# EasyEDA Pro project STM32F429BIT6 IGT6外围.epro, board Demo0
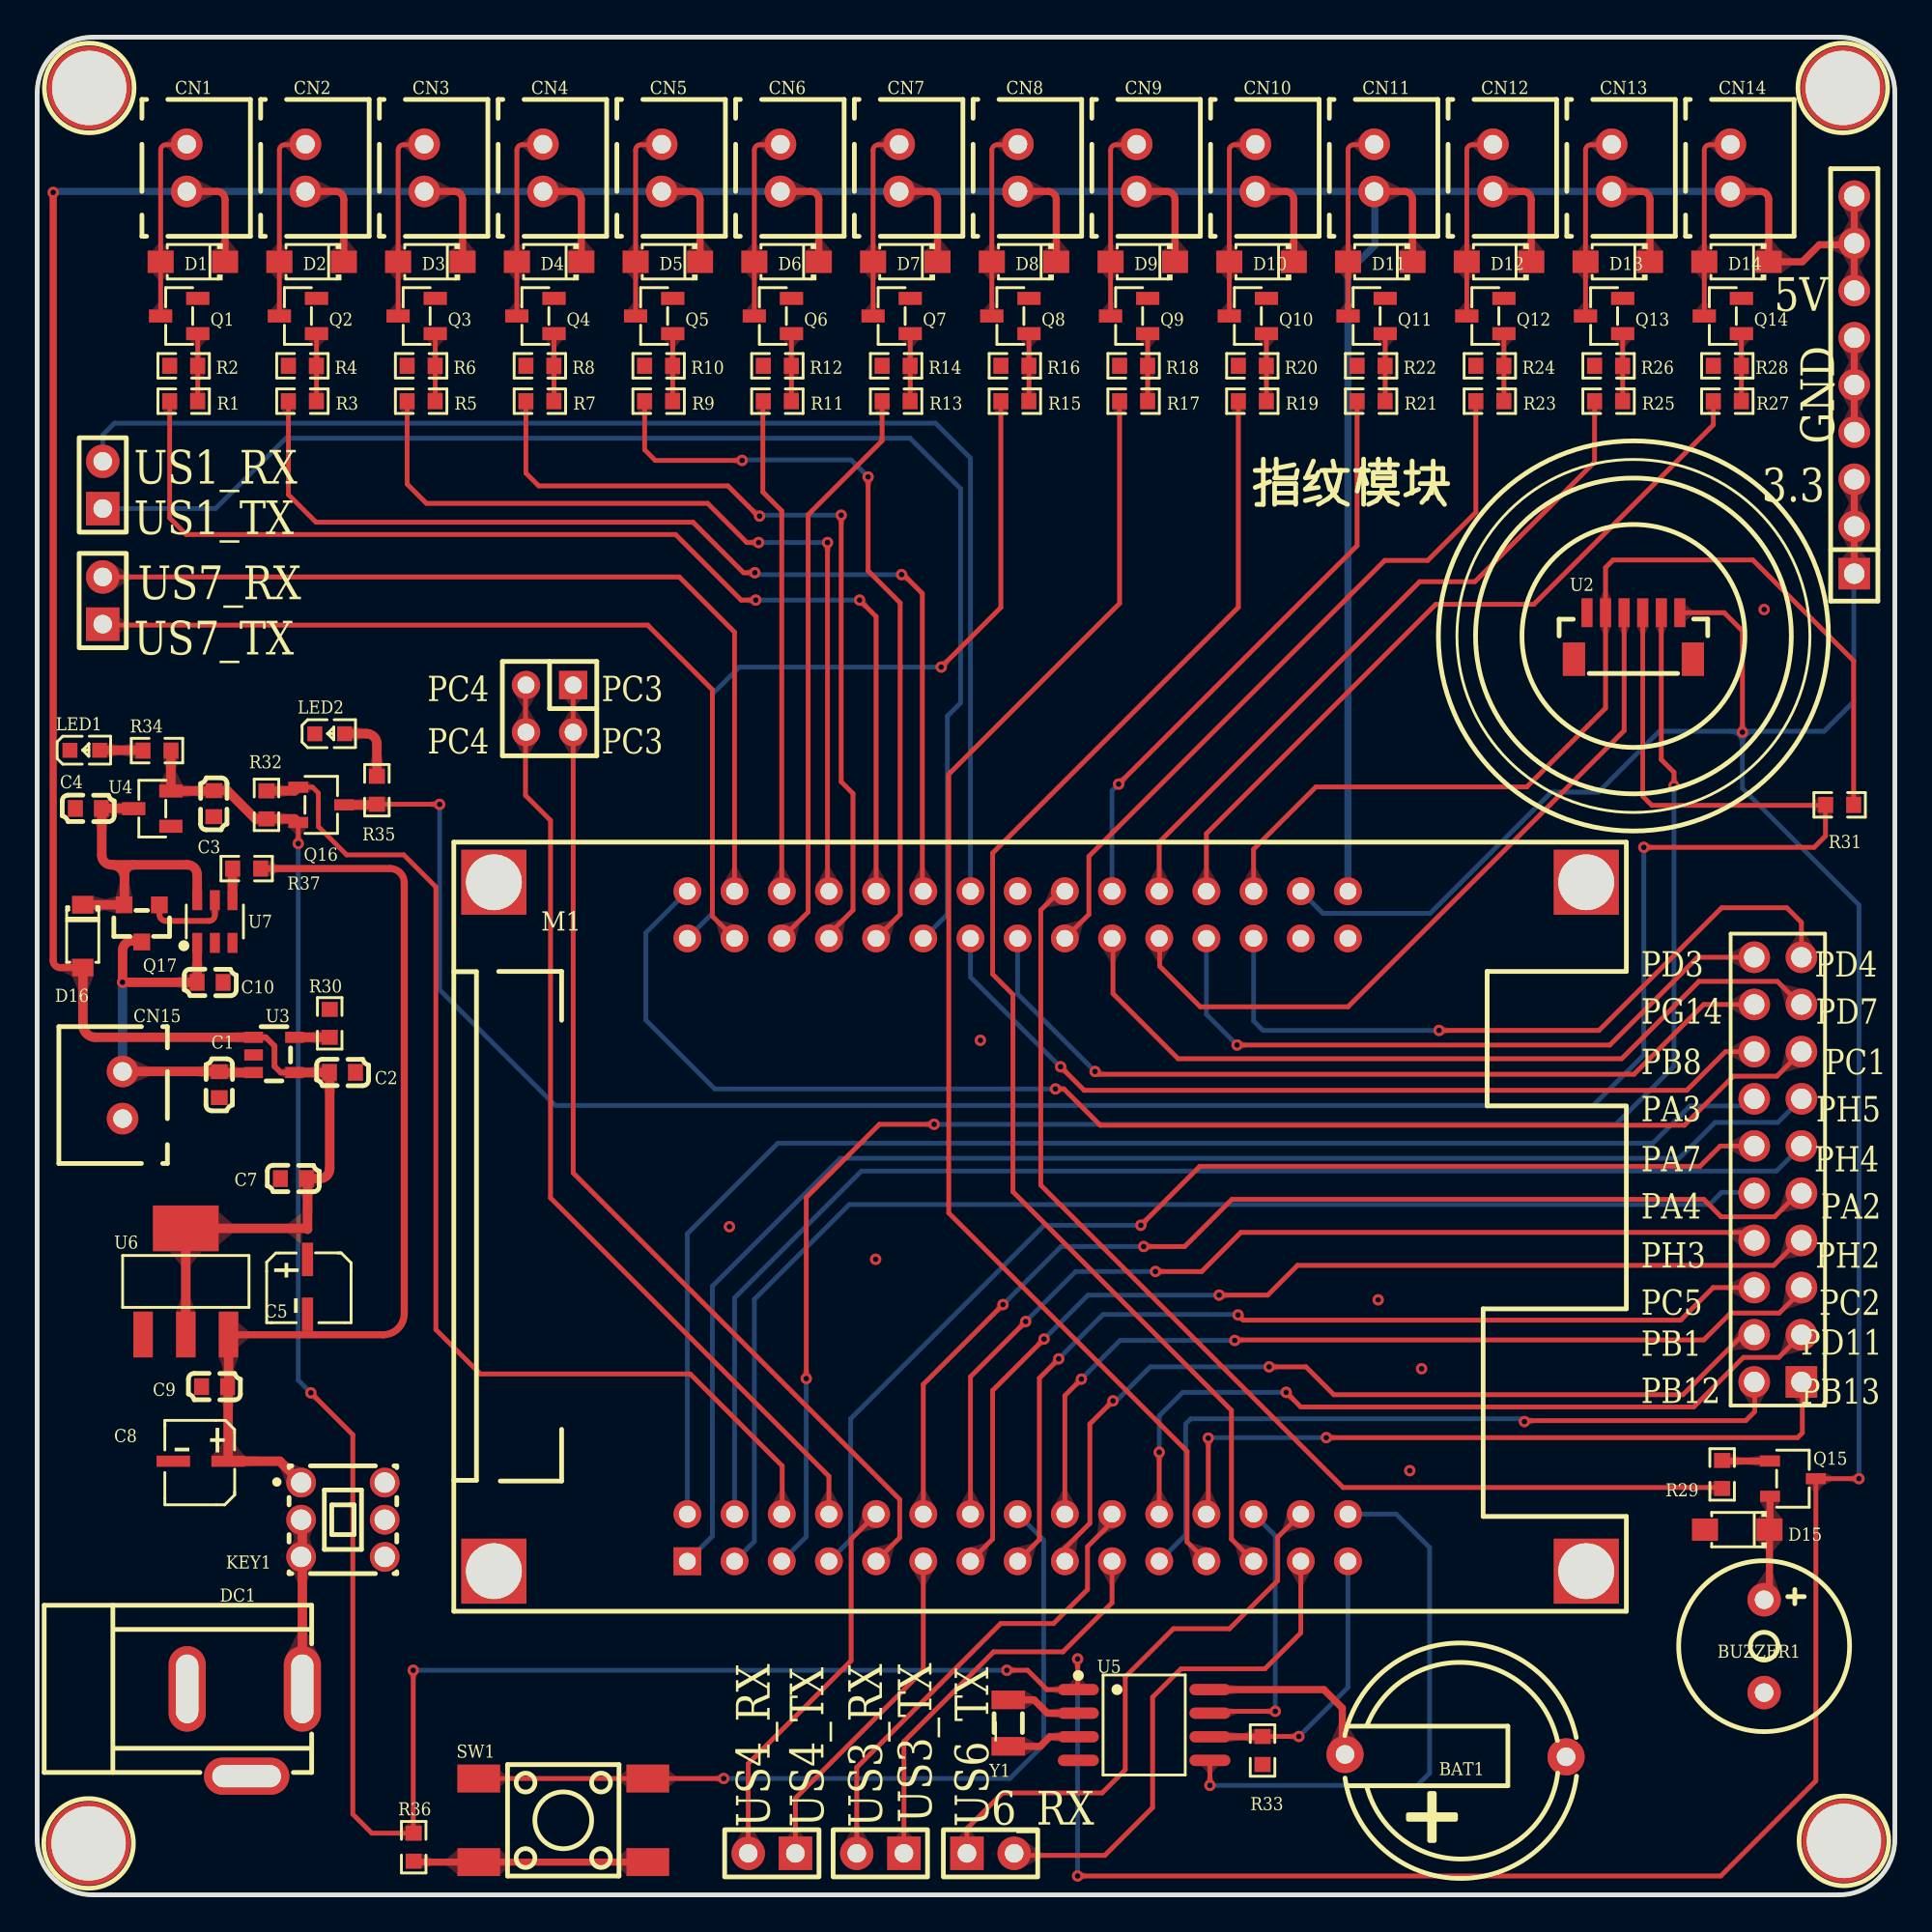
[diagram p3: board, top side]
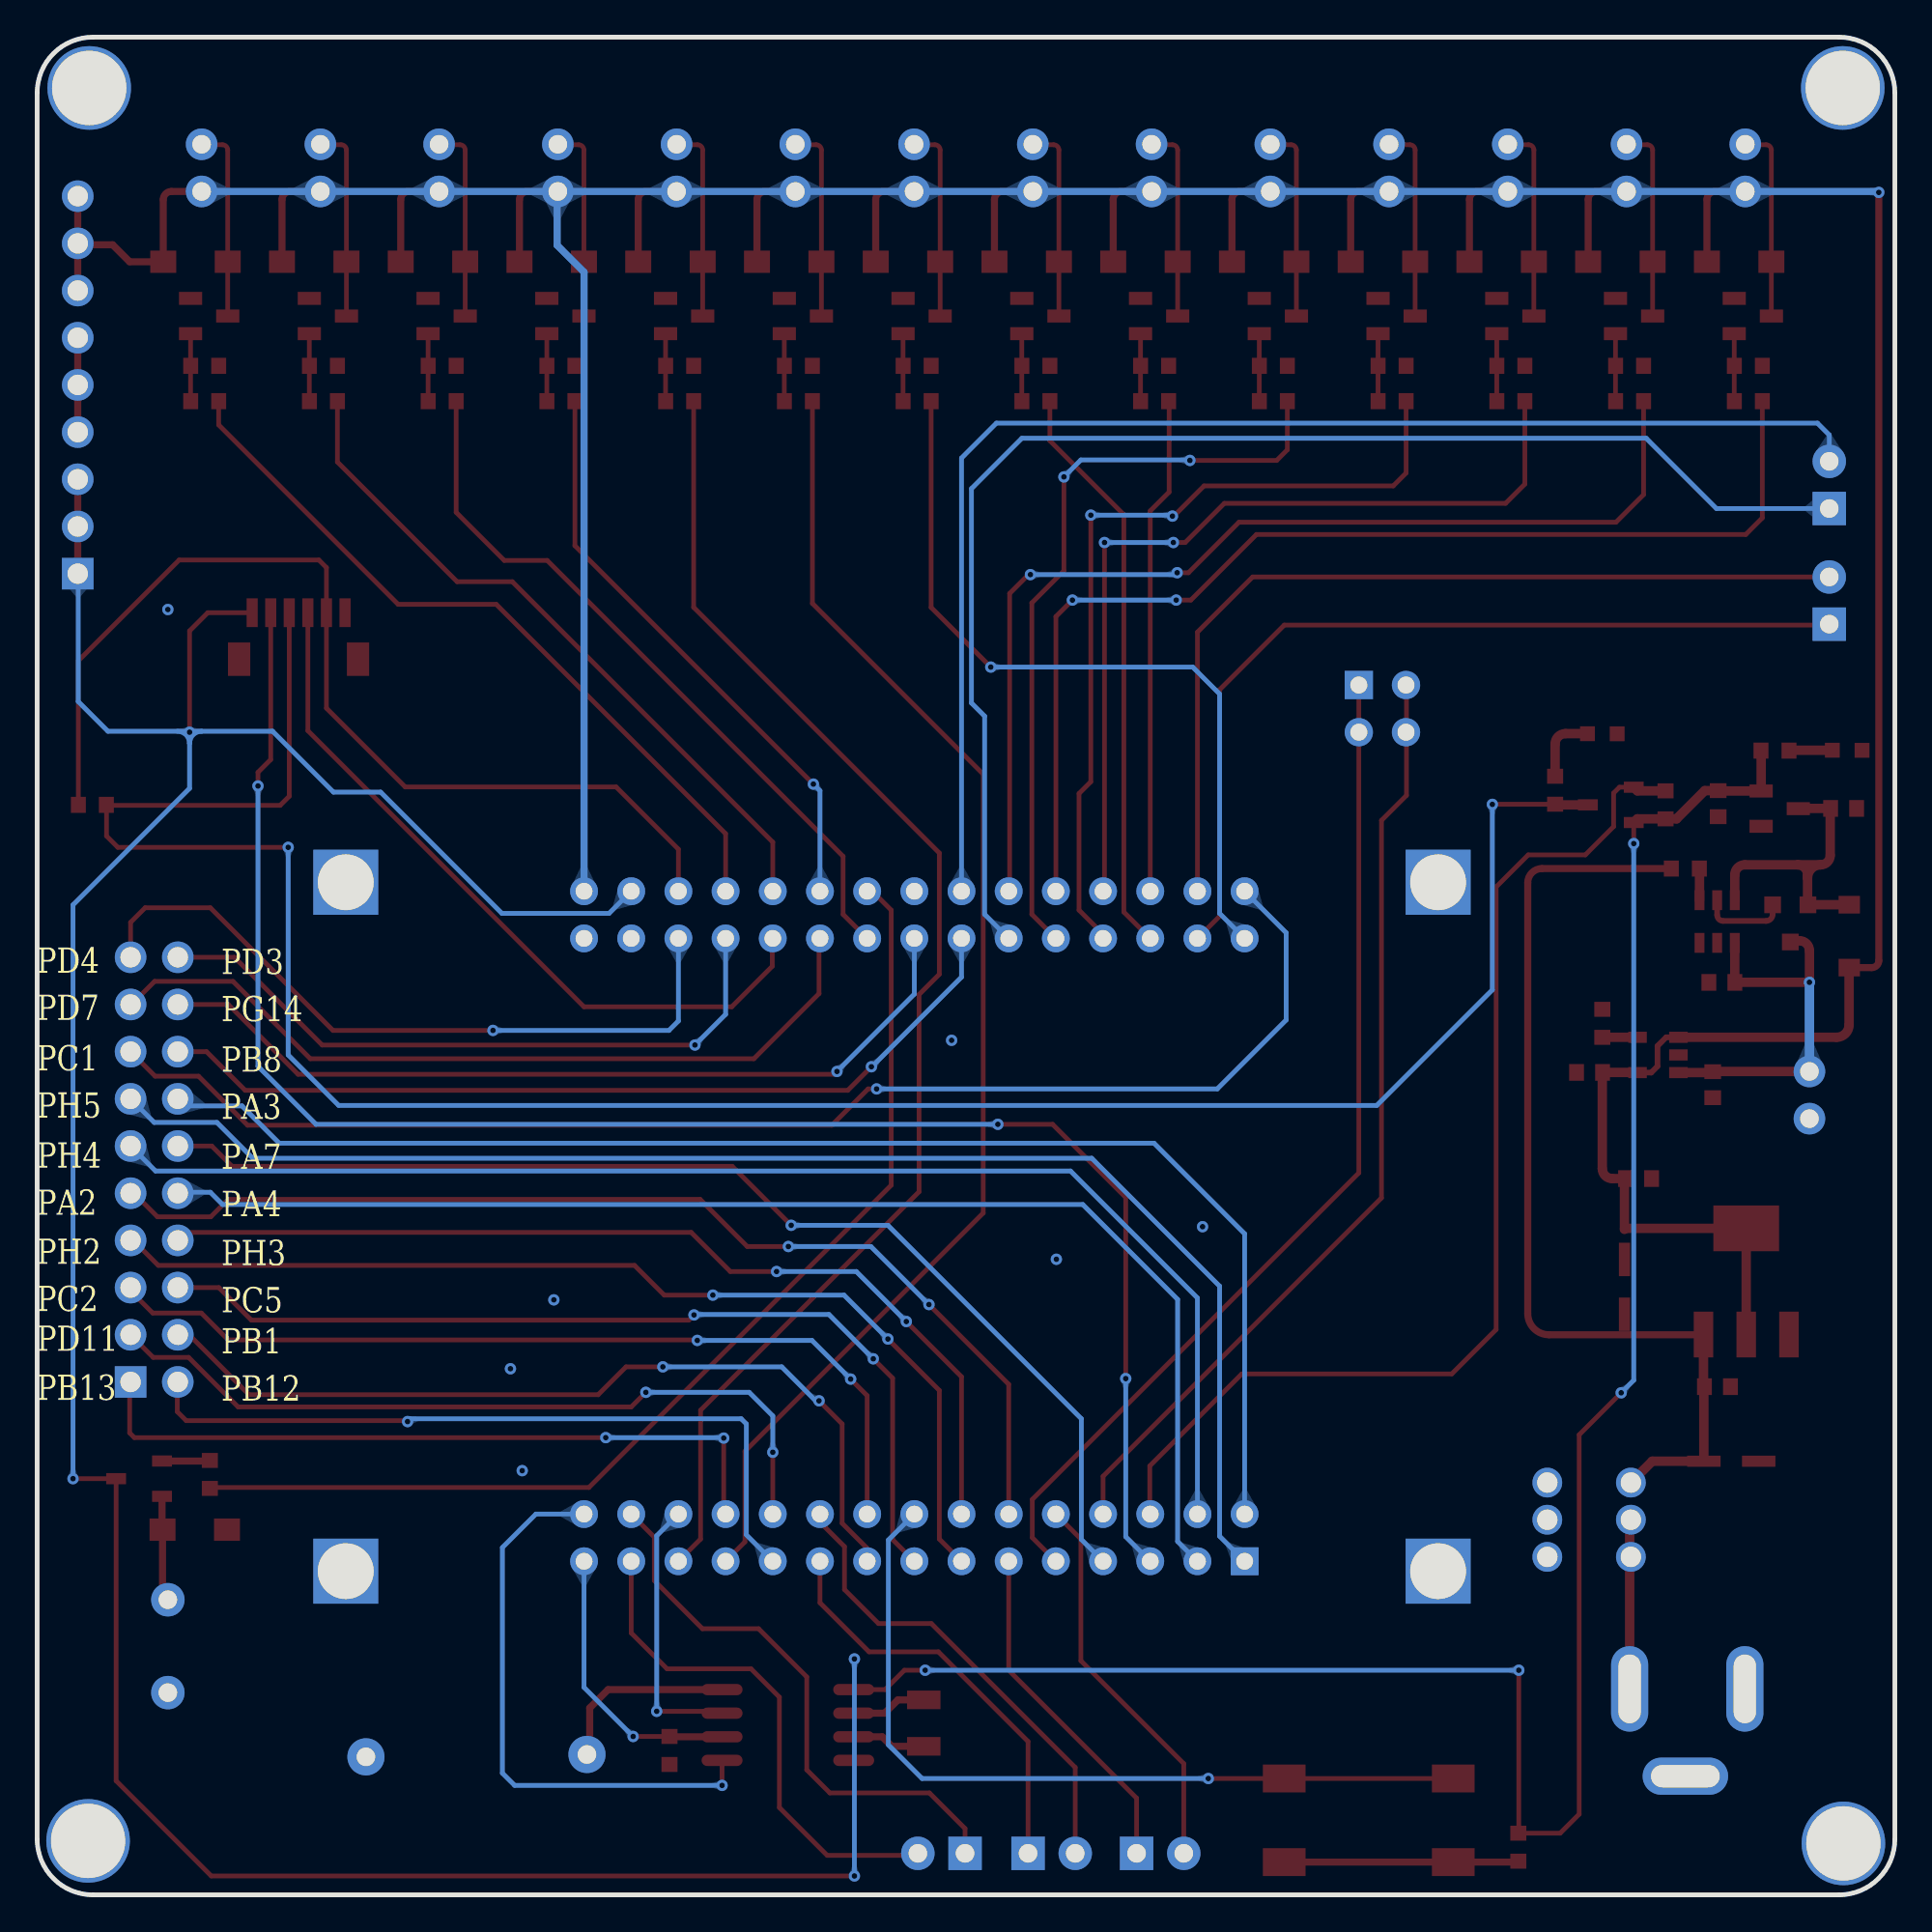
[diagram p4: board, bottom side, seen from below]

Outline 100 x 100 mm; copper layers: Top Layer, Bottom Layer. Coordinates in mm from the lower left corner of the outline.
Outline path: 0,97 0,3 arc(0.88,0.88) 3,0 97,0 arc(99.12,0.88) 100,3 100,97 arc(99.12,99.12) 97,100 3,100 arc(0.88,99.12) 0,97
Stack: Top Layer 0.035mm / Dielectric1 1.51mm FR4 er 4.5 / Bottom Layer 0.035mm

## Design rules (mm)
spacing Default (default): track to track 0.152, other pairs 0 to 0.152
track width Default (default): min 0.254, default 0.254, max 25.4
differential pair differentialPair (default): width min 0.127, default 0.254, max 2.54; gap min 0.152, default 0.152
via Default (default): diameter min 0.61, default 0.61, max 100.025; hole min 0.305, default 0.305, max 59.995

## Placement (name value [footprint] x y rotation side)
BAT1  CR1220-H DIP  [BAT-TH_CR1220-H-DIP]  76.35 7.49 180 top
BUZZER1  2800Hz  [BUZ-TH_BD9.0-P5.00-D0.6-FD]  92.96 13.39 270 top
C1  10uF  [C0603]  9.8 43.61 90 top
C2  10uF  [C0603]  16.43 44.27 180 top
C3  1uF  [C0603]  9.51 58.74 90 top
C4  1uF  [C0603]  2.76 58.48 0 top
C5  22uF  [CAP-SMD_BD6.3-L6.6-W6.6-RD#2]  14.55 34.19 90 top
C7  100nF  [C0603]  13.8 38.56 0 top
C8  22uF  [CAP-SMD_BD6.3-L6.6-W6.6-RD]  8.61 23.09 0 top
C9  100nF  [C0603]  9.55 27.36 0 top
C10  1uF  [C0603]  9.31 49.12 180 top
CN1  B2B-XH-A(LF)(SN)  [CONN-TH_B2B-XH-A-LF-SN]  8.05 92.96 270 top
CN2  B2B-XH-A(LF)(SN)  [CONN-TH_B2B-XH-A-LF-SN]  14.44 92.96 270 top
CN3  B2B-XH-A(LF)(SN)  [CONN-TH_B2B-XH-A-LF-SN]  20.84 92.96 270 top
CN4  B2B-XH-A(LF)(SN)  [CONN-TH_B2B-XH-A-LF-SN]  27.23 92.96 270 top
CN5  B2B-XH-A(LF)(SN)  [CONN-TH_B2B-XH-A-LF-SN]  33.62 92.96 270 top
CN6  B2B-XH-A(LF)(SN)  [CONN-TH_B2B-XH-A-LF-SN]  40.01 92.96 270 top
CN7  B2B-XH-A(LF)(SN)  [CONN-TH_B2B-XH-A-LF-SN]  46.4 92.96 270 top
CN8  B2B-XH-A(LF)(SN)  [CONN-TH_B2B-XH-A-LF-SN]  52.8 92.96 270 top
CN9  B2B-XH-A(LF)(SN)  [CONN-TH_B2B-XH-A-LF-SN]  59.19 92.96 270 top
CN10  B2B-XH-A(LF)(SN)  [CONN-TH_B2B-XH-A-LF-SN]  65.58 92.96 270 top
CN11  B2B-XH-A(LF)(SN)  [CONN-TH_B2B-XH-A-LF-SN]  71.97 92.96 270 top
CN12  B2B-XH-A(LF)(SN)  [CONN-TH_B2B-XH-A-LF-SN]  78.36 92.96 270 top
CN13  B2B-XH-A(LF)(SN)  [CONN-TH_B2B-XH-A-LF-SN]  84.75 92.96 270 top
CN14  B2B-XH-A(LF)(SN)  [CONN-TH_B2B-XH-A-LF-SN]  91.15 92.96 270 top
CN15  B2B-XH-A(LF)(SN)  [CONN-TH_B2B-XH-A-LF-SN]  4.6 43.05 90 top
D1  DSK34  [SOD-123FL_L2.7-W1.8-LS3.8-RD]  8.38 87.91 180 top
D2  DSK34  [SOD-123FL_L2.7-W1.8-LS3.8-RD]  14.77 87.91 180 top
D3  DSK34  [SOD-123FL_L2.7-W1.8-LS3.8-RD]  21.17 87.91 180 top
D4  DSK34  [SOD-123FL_L2.7-W1.8-LS3.8-RD]  27.56 87.91 180 top
D5  DSK34  [SOD-123FL_L2.7-W1.8-LS3.8-RD]  33.95 87.91 180 top
D6  DSK34  [SOD-123FL_L2.7-W1.8-LS3.8-RD]  40.34 87.91 180 top
D7  DSK34  [SOD-123FL_L2.7-W1.8-LS3.8-RD]  46.73 87.91 180 top
D8  DSK34  [SOD-123FL_L2.7-W1.8-LS3.8-RD]  53.13 87.91 180 top
D9  DSK34  [SOD-123FL_L2.7-W1.8-LS3.8-RD]  59.52 87.91 180 top
D10  DSK34  [SOD-123FL_L2.7-W1.8-LS3.8-RD]  65.91 87.91 180 top
D11  DSK34  [SOD-123FL_L2.7-W1.8-LS3.8-RD]  72.3 87.91 180 top
D12  DSK34  [SOD-123FL_L2.7-W1.8-LS3.8-RD]  78.69 87.91 180 top
D13  DSK34  [SOD-123FL_L2.7-W1.8-LS3.8-RD]  85.09 87.91 180 top
D14  DSK34  [SOD-123FL_L2.7-W1.8-LS3.8-RD]  91.48 87.91 180 top
D15  DSK34  [SOD-123FL_L2.7-W1.8-LS3.8-RD]  91.52 19.66 180 top
D16  1N5819W  [SOD-123_L2.8-W1.8-LS3.7-RD]  2.45 51.61 270 top
DC1  DC005  [DC-IN-TH_DC005]  11.18 8.74 0 top
H1  -  [HDR-TH_2P-P2.54-V-M-1]  3.53 75.9 90 top
H2  -  [HDR-TH_2P-P2.54-V-M-1]  45.39 2.24 180 top
H3  -  [HDR-TH_2P-P2.54-V-M-1]  51.32 2.24 0 top
H4  -  [HDR-TH_2P-P2.54-V-M-1]  39.55 2.24 180 top
H5  -  [HDR-TH_2P-P2.54-V-M-1]  3.53 69.67 90 top
H6  -  [HDR-TH_9P-P2.54-V-M]  97.82 81.28 90 top
H7  -  [HDR-TH_20P-P2.54-V-M-R2-C10-S2.54]  93.7 39.04 90 top
H8  -  [HDR-TH_4P-P2.54-V-M-R2-C2-S2.54-1]  27.58 63.86 180 top
KEY1  自锁开关 5.8Z白灰白260G  [SW-TH_6P-L5.8-W5.8-P2.00-LS4.5-TR]  16.46 20.19 90 top
LED1  -  [LED_0603]  2.62 61.62 0 top
LED2  -  [LED_0603]  15.8 62.51 0 top
M1  STM32F429BIT6-Module  [STM32F429BI_CORE]  52.78 35.99 0 top
Q1  AO3400  [SOT-23-3_L2.9-W1.3-P1.90-LS2.4-BR]  7.65 84.99 0 top
Q2  AO3400  [SOT-23-3_L2.9-W1.3-P1.90-LS2.4-BR]  14.04 84.99 0 top
Q3  AO3400  [SOT-23-3_L2.9-W1.3-P1.90-LS2.4-BR]  20.43 84.99 0 top
Q4  AO3400  [SOT-23-3_L2.9-W1.3-P1.90-LS2.4-BR]  26.82 84.99 0 top
Q5  AO3400  [SOT-23-3_L2.9-W1.3-P1.90-LS2.4-BR]  33.21 84.99 0 top
Q6  AO3400  [SOT-23-3_L2.9-W1.3-P1.90-LS2.4-BR]  39.6 84.99 0 top
Q7  AO3400  [SOT-23-3_L2.9-W1.3-P1.90-LS2.4-BR]  46 84.99 0 top
Q8  AO3400  [SOT-23-3_L2.9-W1.3-P1.90-LS2.4-BR]  52.39 84.99 0 top
Q9  AO3400  [SOT-23-3_L2.9-W1.3-P1.90-LS2.4-BR]  58.78 84.99 0 top
Q10  AO3400  [SOT-23-3_L2.9-W1.3-P1.90-LS2.4-BR]  65.17 84.99 0 top
Q11  AO3400  [SOT-23-3_L2.9-W1.3-P1.90-LS2.4-BR]  71.56 84.99 0 top
Q12  AO3400  [SOT-23-3_L2.9-W1.3-P1.90-LS2.4-BR]  77.96 84.99 0 top
Q13  AO3400  [SOT-23-3_L2.9-W1.3-P1.90-LS2.4-BR]  84.35 84.99 0 top
Q14  AO3400  [SOT-23-3_L2.9-W1.3-P1.90-LS2.4-BR]  90.74 84.99 0 top
Q15  S8050  [SOT-23-3_L2.9-W1.6-P1.90-LS2.8-BR]  94.51 22.4 180 top
Q16  SI2305  [SOT-23-3_L2.9-W1.6-P1.90-LS2.8-BR]  15.29 58.67 180 top
Q17  FH3415J  [SOT-23_L2.9-W1.3-P1.90-LS2.4-BL]  5.63 52.29 180 top
R1  1K  [R0603]  7.89 80.4 0 top
R2  10K  [R0603]  7.89 82.31 180 top
R3  1K  [R0603]  14.28 80.4 0 top
R4  10K  [R0603]  14.28 82.31 180 top
R5  1K  [R0603]  20.67 80.4 0 top
R6  10K  [R0603]  20.67 82.31 180 top
R7  1K  [R0603]  27.06 80.4 0 top
R8  10K  [R0603]  27.06 82.31 180 top
R9  1K  [R0603]  33.45 80.4 0 top
R10  10K  [R0603]  33.45 82.31 180 top
R11  1K  [R0603]  39.85 80.4 0 top
R12  10K  [R0603]  39.85 82.31 180 top
R13  1K  [R0603]  46.24 80.4 0 top
R14  10K  [R0603]  46.24 82.31 180 top
R15  1K  [R0603]  52.63 80.4 0 top
R16  10K  [R0603]  52.63 82.31 180 top
R17  1K  [R0603]  59.02 80.4 0 top
R18  10K  [R0603]  59.02 82.31 180 top
R19  1K  [R0603]  65.41 80.4 0 top
R20  10K  [R0603]  65.41 82.31 180 top
R21  1K  [R0603]  71.81 80.4 0 top
R22  10K  [R0603]  71.81 82.31 180 top
R23  1K  [R0603]  78.2 80.4 0 top
R24  10K  [R0603]  78.2 82.31 180 top
R25  1K  [R0603]  84.59 80.4 0 top
R26  10K  [R0603]  84.59 82.31 180 top
R27  1K  [R0603]  90.98 80.4 0 top
R28  10K  [R0603]  90.98 82.31 180 top
R29  1K  [R0603]  90.7 22.63 90 top
R30  2K 1%  [R0603]  15.75 46.91 270 top
R31  10K  [R0603]  97.03 58.67 180 top
R32  100K  [R0603]  12.34 58.67 270 top
R33  10K  [R0603]  65.96 7.77 90 top
R34  5.1K  [R0603]  6.45 61.59 0 top
R35  5.1K  [R0603]  18.29 59.46 270 top
R36  1K  [R0603]  20.27 2.57 90 top
R37  470K  [R0603]  11.28 55.25 180 top
SW1  -  [SW-SMD_4P-L6.0-W6.0-P4.50-LS9.0-2]  28.32 4.01 0 top
TP1  -  [M4螺丝]  2.77 2.77 0 top
TP2  -  [M4螺丝]  97.26 2.9 0 top
TP3  -  [M4螺丝]  2.8 97.27 0 top
TP4  -  [M4螺丝]  97.2 97.27 0 top
U2  指纹模块  [CONN-SMD_A1002WV-S-6P]  85.93 67.77 0 top
U3  LGS7381  [SOT-23-5_L2.9-W1.6-P0.95-LS2.8-BR]  12.75 45.21 180 top
U4  XC6206  [SOT-23-3_L2.9-W1.3-P1.90-LS2.4-BR]  6.2 58.47 0 top
U5  DS1302S+T&R  [SOP-8_L5.3-W5.3-P1.27-LS8.0-BL]  59.59 9.14 270 top
U6  AMS1117-5.0  [SOT-223_L6.5-W3.5-P2.30-LS7.0-BR]  8 33.02 270 top
U7  LTC4412MPS6#TRPBF  [SOT-23-6_L2.9-W1.6-P0.95-LS2.8-BL]  9.57 52.39 0 top
Y1  32.768kHz  [FC-135R_L3.2-W1.5]  52.27 9.25 90 top

## Footprints (pads in the part's own frame, mm; a bottom-side part is the same pattern mirrored in y, then rotated)
BAT-TH_CR1220-H-DIP
  round 2 hole 1: 1(-5.949,0.064) 2(5.949,-0.064)
BUZ-TH_BD9.0-P5.00-D0.6-FD
  round 1.8 hole 1: 1(-2.5,0) 2(2.5,0)
C0603
  rect 0.8x0.9 smd: 1(-0.7,0) 2(0.7,0)
CAP-SMD_BD6.3-L6.6-W6.6-RD
  rect 1.8x0.6 smd: 1(1.67,0.254) 2(-1.282,0.254)
CAP-SMD_BD6.3-L6.6-W6.6-RD#2
  rect 1.8x0.6 smd: 1(0.016,0) 2(-2.936,0)
CONN-SMD_A1002WV-S-6P
  rect 0.6x1.55 smd: 1(2.499,1.251) 2(1.499,1.251) 3(0.501,1.25) 4(-0.501,1.251) 5(-1.501,1.251) 6(-2.501,1.251)
  rect 1.2x1.8 smd: 7(3.201,-1.251) 8(-3.201,-1.251)
CONN-TH_B2B-XH-A-LF-SN
  round 1.7 hole 1: 1(1.27,0) 2(-1.27,0)
DC-IN-TH_DC005
  oval 2x4.6 hole 1.2x3.7: 1(3.1,2.35) 2(-3.1,2.35)
  oval 4.6x2 hole 3.7x1.2: 3(0.1,-2.35)
FC-135R_L3.2-W1.5
  rect 1x1.8 smd: 1(-1.25,0) 2(1.25,0)
HDR-TH_2P-P2.54-V-M-1
  rect 1.8x1.8 hole 1: 1(-1.27,0)
  round 1.8 hole 1: 2(1.27,0)
HDR-TH_4P-P2.54-V-M-R2-C2-S2.54-1
  rect 1.524x1.524 hole 0.914: 1(-1.27,-1.27)
  round 1.524 hole 0.914: 2(-1.27,1.27) 3(1.27,-1.27) 4(1.27,1.27)
HDR-TH_9P-P2.54-V-M
  rect 1.7x1.7 hole 1.1: 1(-10.16,0)
  round 1.7 hole 1.1: 2(-7.62,0) 3(-5.08,0) 4(-2.54,0) 5(0,0) 6(2.54,0) 7(5.08,0) 8(7.62,0) 9(10.16,0)
HDR-TH_20P-P2.54-V-M-R2-C10-S2.54
  rect 1.7x1.7 hole 1.1: 1(-11.43,-1.27)
  round 1.7 hole 1.1: 2(-11.43,1.27) 3(-8.89,-1.27) 4(-8.89,1.27) 5(-6.35,-1.27) 6(-6.35,1.27) 7(-3.81,-1.27) 8(-3.81,1.27) 9(-1.27,-1.27) 10(-1.27,1.27) 11(1.27,-1.27) 12(1.27,1.27) 13(3.81,-1.27) 14(3.81,1.27) 15(6.35,-1.27) 16(6.35,1.27) 17(8.89,-1.27) 18(8.89,1.27) 19(11.43,-1.27) 20(11.43,1.27)
LED_0603
  rect 0.8x0.8 smd: 1(-0.851,-0.01) 2(0.75,-0.005)
M4螺丝
  round 4.5 hole 4: 1(0,0)
R0603
  rect 0.806x0.864 smd: 1(-0.753,0) 2(0.753,0)
SOD-123_L2.8-W1.8-LS3.7-RD
  rect 0.95x1.15 smd: 1(-1.692,0) 2(1.692,0)
SOD-123FL_L2.7-W1.8-LS3.8-RD
  rect 1.4x1.2 smd: 1(-1.735,0) 2(1.735,0)
SOP-8_L5.3-W5.3-P1.27-LS8.0-BL
  oval 0.609x2.204 smd: 1(-1.905,-3.542) 2(-0.635,-3.542) 3(0.635,-3.542) 4(1.905,-3.542) 5(1.905,3.542) 6(0.635,3.542) 7(-0.635,3.542) 8(-1.905,3.542)
SOT-23-3_L2.9-W1.3-P1.90-LS2.4-BR
  rect 1.25x0.7 smd: 1(1,-0.95) 2(1,0.95) 3(-1,0)
SOT-23-3_L2.9-W1.6-P1.90-LS2.8-BR
  rect 1.07x0.6 smd: 1(1.235,-0.95) 2(1.235,0.95) 3(-1.235,0)
SOT-23-5_L2.9-W1.6-P0.95-LS2.8-BR
  rect 1x0.6 smd: 1(1.1,-0.95) 2(1.1,0) 3(1.1,0.95) 4(-1.1,0.95) 5(-1.1,-0.95)
SOT-23-6_L2.9-W1.6-P0.95-LS2.8-BL
  rect 0.532x1.072 smd: 1(-0.95,-1.149) 2(0,-1.149) 3(0.95,-1.149) 4(0.95,1.149) 5(0,1.149) 6(-0.95,1.149)
SOT-23_L2.9-W1.3-P1.90-LS2.4-BL
  rect 0.9x0.9 smd: 1(-0.95,-1) 2(0.95,-1) 3(0,1)
SOT-223_L6.5-W3.5-P2.30-LS7.0-BR
  rect 2.465x1.05 smd: 1(2.857,-2.3) 2(2.857,0) 3(2.857,2.3)
  rect 2.465x3.54 smd: 4(-2.857,0)
STM32F429BI_CORE
  rect 3.5x3.5 hole 3.005x3: 0(30.607,18.517) 61(30.607,-18.567) 62(-28.194,-18.567) 63(-28.194,18.517)
  rect 1.5x1.5 hole 0.905x0.9: 1(-17.78,-18.034)
  round 1.5 hole 0.905x0.9: 2(-17.78,-15.494) 3(-15.24,-18.034) 4(-15.24,-15.494) 5(-12.7,-18.034) 6(-12.7,-15.494) 7(-10.16,-18.034) 8(-10.16,-15.494) 9(-7.62,-18.034) 10(-7.62,-15.494) 11(-5.08,-18.034) 12(-5.08,-15.494) 13(-2.54,-18.034) 14(-2.54,-15.494) 15(0,-18.034) 16(0,-15.494) 17(2.54,-18.034) 18(2.54,-15.494) 19(5.08,-18.034) 20(5.08,-15.494) 21(7.62,-18.034) 22(7.62,-15.494) 23(10.16,-18.034) 24(10.16,-15.494) 25(12.7,-18.034) 26(12.7,-15.494) 27(15.24,-18.034) 28(15.24,-15.494) 29(17.78,-18.034) 30(17.78,-15.494) 31(-17.78,15.494) 32(-17.78,18.034) 33(-15.24,15.494) 34(-15.24,18.034) 35(-12.7,15.494) 36(-12.7,18.034) 37(-10.16,15.494) 38(-10.16,18.034) 39(-7.62,15.494) 40(-7.62,18.034) 41(-5.08,15.494) 42(-5.08,18.034) 43(-2.54,15.494) 44(-2.54,18.034) 45(0,15.494) 46(0,18.034) 47(2.54,15.494) 48(2.54,18.034) 49(5.08,15.494) 50(5.08,18.034) 51(7.62,15.494) 52(7.62,18.034) 53(10.16,15.494) 54(10.16,18.034) 55(12.7,15.494) 56(12.7,18.034) 57(15.24,15.494) 58(15.24,18.034) 59(17.78,15.494) 60(17.78,18.034)
SW-SMD_4P-L6.0-W6.0-P4.50-LS9.0-2
  rect 2.3x1.5 smd: 1(-4.55,2.25) 2(4.55,2.25) 3(-4.55,-2.25) 4(4.55,-2.25)
SW-TH_6P-L5.8-W5.8-P2.00-LS4.5-TR
  round 1.6 hole 1.1: 1(2,2.25) 2(0,2.25) 3(-2,2.25) 4(-2,-2.25) 5(0,-2.25) 6(2,-2.25)

## Nets
+3.3V: C3.2 H6.1 H6.2 H6.3 M1.58 Q15.3 Q16.2 R32.2 R34.2 R36.2 U2.1 U4.2 U5.1
+5V: C2.2 C5.1 C7.2 CN1.1 CN2.1 CN3.1 CN4.1 CN5.1 CN6.1 CN7.1 CN8.1 CN9.1 CN10.1 CN11.1 CN12.1 CN13.1 CN14.1 D1.1 D2.1 D3.1 D4.1 D5.1 D6.1 D7.1 D8.1 D9.1 D10.1 D11.1 D12.1 D13.1 D14.1 D16.2 H6.7 H6.8 H6.9 M1.60 U3.1 U3.4 U6.2 U6.4
GND: BAT1.1 BUZZER1.2 C1.1 C2.1 C3.1 C4.1 C5.2 C7.1 C8.2 C9.1 C10.1 CN15.2 D15.2 DC1.2 DC1.3 H6.4 H6.5 H6.6 LED1.1 LED2.1 M1.59 Q1.2 Q2.2 Q3.2 Q4.2 Q5.2 Q6.2 Q7.2 Q8.2 Q9.2 Q10.2 Q11.2 Q12.2 Q13.2 Q14.2 R2.2 R4.2 R6.2 R8.2 R10.2 R12.2 R14.2 R16.2 R18.2 R20.2 R22.2 R24.2 R26.2 R28.2 R30.1 R33.1 U2.6 U3.2 U4.1 U5.4 U6.1 U7.2 U7.3
VBAT: C1.2 C10.2 CN15.1 Q17.3 U3.3 U7.1
VCC: C8.1 C9.2 KEY1.1 R37.1 U6.3
AF8_USART4_RX: H4.2 M1.10
AF8_USART4_TX: H4.1 M1.11
AF8_USART7_RX: H5.2 M1.34
AF8_USART7_TX: H5.1 M1.33
BUZZER: M1.48 R29.1
DC-DC_OUT: C4.2 D16.1 Q17.2 U4.3 U7.6
DS1302_CE: M1.30 U5.5
DS1302_I/O: M1.29 R33.2 U5.6
DS1302_SWCLK: M1.26 U5.7
KEY_SOS: M1.16 SW1.1 SW1.2
PA2: H7.9 M1.12
PA3: H7.14 M1.2
PA4: H7.10 M1.3
PA7: H7.12 M1.7
PB1: H7.4 M1.17
PB8: H7.16 M1.43
PB12: H7.2 M1.21
PB13: H7.1 M1.24
PC1: H7.15 M1.32
PC2: H7.5 M1.18
PC3: H8.1 H8.2 M1.9
PC4: H8.3 H8.4 M1.8
PC5: H7.6 M1.15
PD3: H7.20 M1.53
PD4: H7.19 M1.55
PD7: H7.17 M1.49
PD11: H7.3 M1.22
PG14: H7.18 M1.45
PH2: H7.7 M1.13
PH3: H7.8 M1.14
PH4: H7.11 M1.4
PH5: H7.13 M1.1
POW_EN: M1.6 Q16.1 R32.1
SW1: M1.40 R1.1
SW2: M1.42 R3.1
SW3: M1.38 R5.1
SW4: M1.37 R7.1
SW5: M1.39 R9.1
SW6: M1.36 R11.1
SW7: M1.35 R13.1
SW8: M1.31 R15.1
SW9: M1.23 R17.1
SW10: M1.25 R19.1
SW11: M1.50 R21.1
SW12: M1.47 R23.1
SW13: M1.52 R25.1
SW14: M1.54 R27.1
TOUCH3.3V: Q16.3 R31.2 R35.2 U2.3
TOUCH_OUT: M1.5 U2.2
TOUCH_RX: M1.56 R31.1 U2.5
TOUCH_TX: M1.51 U2.4
USART1_RX: H1.2 M1.44
USART1_TX: H1.1 M1.41
USART3_RX: H2.2 M1.20
USART3_TX: H2.1 M1.19
USART6_RX: H3.2 M1.27
USART6_TX: H3.1 M1.28
$1N5077: BAT1.2 U5.8
$1N5199: U5.2 Y1.2
$1N5205: U5.3 Y1.1
$1N8903: R36.1 SW1.3 SW1.4
$2N2294: CN1.2 D1.2 Q1.3
$2N2302: Q1.1 R1.2 R2.1
$2N2313: CN2.2 D2.2 Q2.3
$2N2321: Q2.1 R3.2 R4.1
$2N2332: CN3.2 D3.2 Q3.3
$2N2340: Q3.1 R5.2 R6.1
$2N2351: CN4.2 D4.2 Q4.3
$2N2359: Q4.1 R7.2 R8.1
$2N2370: CN5.2 D5.2 Q5.3
$2N2378: Q5.1 R9.2 R10.1
$2N2389: CN6.2 D6.2 Q6.3
$2N2397: Q6.1 R11.2 R12.1
$2N2408: CN7.2 D7.2 Q7.3
$2N2416: Q7.1 R13.2 R14.1
$2N2427: CN8.2 D8.2 Q8.3
$2N2435: Q8.1 R15.2 R16.1
$2N2446: CN9.2 D9.2 Q9.3
$2N2454: Q9.1 R17.2 R18.1
$2N2465: CN10.2 D10.2 Q10.3
$2N2473: Q10.1 R19.2 R20.1
$2N2484: CN11.2 D11.2 Q11.3
$2N2492: Q11.1 R21.2 R22.1
$2N2503: CN12.2 D12.2 Q12.3
$2N2511: Q12.1 R23.2 R24.1
$2N2522: CN13.2 D13.2 Q13.3
$2N2530: Q13.1 R25.2 R26.1
$2N2541: CN14.2 D14.2 Q14.3
$2N2549: Q14.1 R27.2 R28.1
$2N2772: BUZZER1.1 D15.1 Q15.2
$2N2814: Q15.1 R29.2
$4N1040: R30.2 U3.5
$4N2282: LED1.2 R34.1
$4N2367: LED2.2 R35.1
$4N3097: Q17.1 U7.5
$4N3104: R37.2 U7.4
$4N4057: DC1.1 KEY1.2 KEY1.3

Pads without a net: KEY1 4 5 6; M1 0 46 57 61 62 63; TP1 1; TP2 1; TP3 1; TP4 1; U2 7 8

## Via types
v1: diameter 0.61, hole 0.305, Top Layer to Bottom Layer, 61 vias

## Routing (per net, layer and track width the routed paths; a pad name or vN(x,y) marks a point on that pad's centre or on a via; arc(x,y) is an arc through that point)
+3.3V: length 287.9
  Top Layer w0.254: v1(56.01,12.7) 56.01,11.09 U5.1 54.36,11.05 53.31,12.09 v1(52.2,12.09) ; Q16.2 v1(14.06,56.59) ; v1(14.73,27.03) 16.99,24.77 16.99,4.34 18.02,3.32 R36.2 20.24,3.34 v1(20.24,12.09) ; v1(91.8,62.59) 91.8,68.04 90.81,69.02 U2.1 ; v1(98.07,22.4) Q15.3 95.75,6.14 90.63,1.02 v1(56.01,1.02)
  Top Layer w0.381: H6.3 H6.2 H6.1
  Top Layer w0.508: Q16.2 13.86,57.92 R32.2 11.75,57.92 10.23,59.44 C3.2 arc(9.51,59.43) 9.49,59.42 U4.2 7.2,61.59 arc(7.2,61.59) R34.2
  Bottom Layer w0.254: 91.8,61.99 91.8,59.56 98.07,53.29 v1(98.07,22.4) ; 91.8,61.99 v1(91.8,62.59) ; 91.8,61.99 arc(91.99,62.45) 92.45,62.64 ; 91.8,61.99 arc(91.61,62.45) 91.15,62.64 ; 91.15,62.64 87.32,62.64 84.05,59.36 81.51,59.36 74.98,52.83 69.22,52.83 68.02,54.03 ; 91.15,62.64 96.19,62.64 97.79,64.24 97.79,71.09 H6.1 ; v1(56.01,1.02) v1(56.01,12.7) ; v1(14.06,56.59) 14.06,27.7 v1(14.73,27.03) ; v1(52.2,12.09) v1(20.24,12.09)
+5V: length 301.4
  Top Layer w0.305: 13.85,44.26 13.12,44.26 12.78,44.6 12.78,45.69 12.31,46.16 11.65,46.16
  Top Layer w0.381: D9.1 61.25,91.25 arc(61.12,91.57) 60.81,91.69 CN9.1 ; H6.8 H6.9 ; H6.8 97.74,88.82 95.94,88.82 95.02,87.91 D14.1 93.21,91.25 arc(93.08,91.57) 92.77,91.69 CN14.1 ; H6.8 H6.7 ; D4.1 29.29,91.25 arc(29.16,91.57) 28.85,91.69 CN4.1 ; D8.1 54.86,91.25 arc(54.73,91.57) 54.42,91.69 CN8.1 ; D11.1 74.04,91.25 arc(73.91,91.57) 73.6,91.69 CN11.1 ; CN13.1 86.38,91.69 arc(86.69,91.57) 86.82,91.25 D13.1 ; D10.1 67.64,91.25 arc(67.52,91.57) 67.2,91.69 CN10.1 ; CN12.1 79.99,91.69 arc(80.3,91.57) 80.43,91.25 D12.1 ; v1(0.86,91.64) 0.86,50.29 arc(0.97,50.02) 1.24,49.91 D16.2 ; CN3.1 22.46,91.69 arc(22.77,91.57) 22.9,91.25 D3.1 ; D5.1 35.68,91.25 arc(35.56,91.57) 35.25,91.69 CN5.1 ; D2.1 16.51,91.25 arc(16.38,91.57) 16.07,91.69 CN2.1 ; D1.1 10.12,91.25 arc(9.99,91.57) 9.68,91.69 CN1.1 ; D6.1 42.08,91.25 arc(41.95,91.57) 41.64,91.69 CN6.1 ; CN7.1 48.03,91.69 arc(48.34,91.57) 48.47,91.25 D7.1
  Top Layer w0.508: 11.65,46.16 3.14,46.16 arc(2.66,46.36) 2.46,46.84 2.46,50.08 arc(2.46,50.09) 2.45,50.09 ; U6.2 U6.4 14.51,35.88 arc(14.54,35.86) 14.55,35.83 14.55,38.5 arc(14.54,38.54) C7.2 15.21,38.56 arc(15.59,38.71) 15.75,39.09 15.75,44.26 arc(15.74,44.27) C2.2 13.86,44.27 arc(13.85,44.27) 13.85,44.26
  Bottom Layer w0.381: 8.41,91.69 CN2.1 CN3.1 CN4.1 CN5.1 CN6.1 CN7.1 CN8.1 CN9.1 CN10.1 CN11.1 ; 8.41,91.69 8.31,91.69 ; 8.41,91.69 arc(8.4,91.66) 8.36,91.64 8.31,91.69 ; CN11.1 CN12.1 CN13.1 CN14.1 ; CN11.1 72.01,91.66 72.01,88.8 70.56,87.35 70.56,54.03 ; 8.31,91.69 CN1.1 0.91,91.69 v1(0.86,91.64)
GND: length 5.1
  Top Layer w0.381: H6.6 H6.5 H6.4
  vias: v1(37.27,35.97) v1(45.14,34.21) v1(50.77,46) v1(72.19,32.03) v1(73.89,22.83) v1(74.52,28.32) v1(92.96,69.19)
VBAT: length 21.1
  Top Layer w0.508: CN15.1 9.79,44.32 arc(9.8,44.32) C1.2 arc(9.82,44.28) 9.85,44.26 11.65,44.26 ; 8.61,49.12 v1(4.6,49.12) 4.6,50.83 arc(4.75,51.2) 5.13,51.36 5.56,51.36 arc(5.61,51.34) Q17.3 ; 8.61,49.12 arc(8.61,49.13) 8.62,49.13 U7.1 ; 8.61,49.12 arc(8.61,49.12) C10.2
  Bottom Layer w0.508: CN15.1 v1(4.6,49.12)
VCC: length 52.7
  Top Layer w0.381: R37.1 19,55.25 arc(19.54,55.02) 19.76,54.48 19.76,31.29 arc(19.43,30.48) 18.62,30.15 10.31,30.15 arc(10.3,30.15) U6.3
  Top Layer w0.508: U6.3 10.3,27.41 arc(10.29,27.37) C9.2 arc(10.27,27.35) 10.28,27.33 C8.1 13.06,23.34 KEY1.1
AF8_USART4_RX: length 21.1
  Top Layer w0.254: H4.2 38.28,7.06 43.81,12.6 43.81,19.15 M1.10
AF8_USART4_TX: length 18.6
  Top Layer w0.254: M1.11 47.7,12.09 40.82,5.21 H4.1
AF8_USART7_RX: length 49.2
  Top Layer w0.254: 37.54,54.03 37.54,67.97 34.57,70.94 H5.2
AF8_USART7_TX: length 48.2
  Top Layer w0.254: H5.1 3.58,68.35 32.87,68.35 36.35,64.87 36.35,52.68 M1.33
BUZZER: length 60
  Top Layer w0.254: R29.1 90.65,21.93 70.3,21.93 54.03,38.2 54.03,53.01 55.04,54.03 55.32,54.03
DC-DC_OUT: length 17.2
  Top Layer w0.508: 5.23,55.45 8.08,55.45 arc(8.46,55.29) 8.62,54.91 U7.6 ; 5.23,55.45 3.99,55.45 ; 5.23,55.45 arc(4.86,55.29) 4.7,54.91 4.7,54.74 ; 4.7,54.74 4.7,53.31 arc(4.69,53.3) Q17.2 arc(4.68,53.3) 4.67,53.3 D16.1 ; 4.7,54.74 arc(4.49,55.24) 3.99,55.45 ; C4.2 5.19,58.48 arc(5.19,58.48) U4.3 ; 3.48,58.38 3.48,55.96 arc(3.63,55.6) 3.99,55.45 ; 3.48,58.38 arc(3.47,58.4) 3.46,58.41 arc(3.47,58.4) 3.48,58.38
DS1302_CE: length 30.7
  Top Layer w0.254: 63.13,7.24 v1(63.13,5.89)
  Bottom Layer w0.254: v1(63.13,5.89) 74.29,5.89 74.96,6.55 74.96,18.69 73.15,20.5 M1.30
DS1302_I/O: length 15.3
  Top Layer w0.254: R33.2 v1(67.92,8.53)
  Top Layer w0.381: 63.13,8.51 65.95,8.51 arc(65.96,8.51) R33.2
  Bottom Layer w0.254: M1.29 70.56,11.17 v1(67.92,8.53)
DS1302_SWCLK: length 14.7
  Top Layer w0.254: v1(66.65,9.88) 63.23,9.88 63.13,9.78
  Bottom Layer w0.254: v1(66.65,9.88) 66.65,19.33 M1.26
KEY_SOS: length 44.2
  Top Layer w0.254: SW1.1 32.87,6.26 ; SW1.2 v1(36.96,6.26)
  Bottom Layer w0.254: M1.16 54.18,19.1 54.18,8.08 52.36,6.26 v1(36.96,6.26)
PA2: length 59.3
  Top Layer w0.254: 94.97,37.77 94.79,37.77 93.52,36.5 90.65,36.5 89.71,37.44 64.31,37.44 61.77,34.9 v1(59.56,34.9) ; v1(51.99,31.78) 47.7,27.48 M1.12
  Bottom Layer w0.254: v1(51.99,31.78) 55.12,34.9 v1(59.56,34.9)
PA3: length 75.5
  Bottom Layer w0.254: H7.14 92.05,42.47 88.98,42.47 86.97,40.46 39.88,40.46 35,35.59 M1.2
PA4: length 70.8
  Bottom Layer w0.254: H7.10 92.38,37.82 90.68,37.82 90.02,37.16 43.71,37.16 38.61,32.05 38.61,19.02 M1.3
PA7: length 62.9
  Top Layer w0.254: v1(59.41,36.04) 62.59,39.22 89.51,39.22 90.6,40.31 H7.12
  Bottom Layer w0.254: v1(59.41,36.04) 54.2,36.04 43.79,25.63 43.79,19.13 M1.7
PB1: length 46.9
  Top Layer w0.254: M1.17 55.32,18.66 56.67,20 56.67,25.35 v1(57.91,26.59) ; v1(66.32,28.42) 68.3,28.42 69.8,26.92 88.59,26.92 91.82,30.15 H7.4
  Bottom Layer w0.254: v1(66.32,28.42) 59.92,28.42 58.09,26.59 v1(57.91,26.59)
PB8: length 47.7
  Top Layer w0.254: H7.16 90.88,45.39 88.8,43.31 56.36,43.31 v1(55.09,44.58)
  Bottom Layer w0.254: M1.43 50.24,49.4 55.07,44.58 v1(55.09,44.58)
PB12: length 40.6
  Top Layer w0.254: H7.2 92.46,27.58 92.46,26.01 91.97,25.53 80.11,25.53 v1(80.06,25.48)
  Bottom Layer w0.254: v1(80.06,25.48) 79.91,25.63 62.1,25.63 61.82,25.35 61.82,19.38 M1.21
PB13: length 38.6
  Top Layer w0.254: v1(63.04,24.59) 63.04,20.6 M1.24 ; 95.02,27.25 95.02,24.87 94.77,24.61 v1(69.39,24.61)
  Bottom Layer w0.254: v1(63.04,24.59) 63.07,24.61 v1(69.39,24.61)
PC1: length 74.1
  Top Layer w0.254: 94.97,45.39 93.65,44.07 91.31,44.07 88.67,41.43 57.23,41.43 55.27,43.38 v1(54.81,43.38)
  Bottom Layer w0.254: v1(54.81,43.38) 36.47,43.38 32.77,47.09 32.77,51.79 35,54.03
PC2: length 48.5
  Top Layer w0.254: v1(64.47,29.84) 64.49,29.87 89.71,29.87 91.16,31.32 93.78,31.32 94.97,32.51 94.97,32.69 ; M1.18 55.32,26.87 v1(56.21,27.76)
  Bottom Layer w0.254: v1(56.21,27.76) 58.29,29.84 v1(64.47,29.84)
PC3: length 55
  Top Layer w0.254: H8.1 H8.2 28.85,38.86 46.43,21.28 46.43,19.23 M1.9
PC4: length 51.4
  Top Layer w0.254: H8.3 26.29,65.1 26.29,59.18 27.63,57.84 27.63,37.52 42.62,22.53 M1.8
PC5: length 51.1
  Top Layer w0.254: M1.15 53.95,19.13 53.95,27.81 v1(54.99,28.85) ; v1(64.64,31.22) 64.92,30.94 88.47,30.94 90.22,32.69 H7.6
  Bottom Layer w0.254: v1(54.99,28.85) 57.38,31.24 64.57,31.24 64.59,31.22 v1(64.64,31.22)
PD3: length 36.2
  Top Layer w0.254: H7.20 89.38,50.47 84.66,45.75 v1(64.59,45.75)
  Bottom Layer w0.254: v1(64.59,45.75) 62.94,47.4 M1.53
PD4: length 39.1
  Top Layer w0.254: v1(75.46,46.53) 84.07,46.53 90.68,53.14 94.18,53.14 94.97,52.35 94.97,50.47
  Bottom Layer w0.254: v1(75.46,46.53) 65.99,46.53 65.48,47.04 M1.55
PD7: length 43.7
  Top Layer w0.254: 94.97,47.93 94.92,47.93 93.67,49.17 89.46,49.17 85.29,45.01 61.42,45.01 57.91,48.51 57.91,51.44 M1.49
PD11: length 42.3
  Top Layer w0.254: 94.97,30.15 93.75,28.93 91.85,28.93 89.18,26.26 68.02,26.26 v1(67.23,27.05) ; M1.22 v1(60.4,23.83)
  Bottom Layer w0.254: v1(67.23,27.05) 61.67,27.05 60.4,25.78 v1(60.4,23.83)
PG14: length 46
  Top Layer w0.254: v1(56.95,44.32) 57.1,44.17 85.95,44.17 89.71,47.93 H7.18
  Bottom Layer w0.254: v1(56.95,44.32) 52.78,48.49 M1.45
PH2: length 56.6
  Top Layer w0.254: v1(54.2,29.92) 51.44,27.15 51.44,19.15 M1.13 ; 94.97,35.23 94.83,35.23 93.48,33.88 67.84,33.88 66.24,32.28 v1(63.63,32.28)
  Bottom Layer w0.254: v1(54.2,29.92) 56.57,32.28 v1(63.63,32.28)
PH3: length 52.9
  Top Layer w0.254: M1.14 50.24,27.89 v1(53.21,30.86) ; v1(60.2,33.55) 62.69,33.55 64.8,35.66 92,35.66 H7.8
  Bottom Layer w0.254: 60.12,33.55 55.91,33.55 v1(53.21,30.86)
PH4: length 72.5
  Bottom Layer w0.254: M1.4 37.54,32.13 44.37,38.96 93.62,38.96 94.97,40.31
PH5: length 78.2
  Bottom Layer w0.254: 94.97,42.85 93.7,41.58 90.32,41.58 88.39,39.65 43.23,39.65 36.35,32.77 36.35,19.3 M1.1
POW_EN: length 60.6
  Top Layer w0.254: M1.6 40.11,20.52 40.11,23.09 35.15,28.04 23.85,28.04 21.46,30.43 21.46,54.25 19.74,55.98 16.66,55.98 15.14,57.51 15.14,59.31 14.82,59.62 Q16.1
  Top Layer w0.508: R32.1 13.86,59.43 Q16.1
SW1: length 61.4
  Top Layer w0.254: v1(44.27,69.7) 45.16,68.81 45.16,54.03 ; 38.63,69.65 38.58,69.7 37.9,69.7 34.37,73.23 8.03,73.23 7.13,74.12 R1.1 ; 38.63,69.65 38.73,69.65 ; 38.63,69.65 v1(38.68,69.7)
  Bottom Layer w0.254: v1(44.27,69.7) v1(38.68,69.7)
SW2: length 57.4
  Top Layer w0.254: R3.1 13.52,75.37 15.01,73.89 35.31,73.89 38.02,71.17 v1(38.63,71.17) ; v1(46.53,71.07) 46.63,71.07 47.65,70.05 47.65,54.08 47.7,54.03
  Bottom Layer w0.254: v1(46.53,71.07) 38.73,71.07 v1(38.63,71.17)
SW3: length 47.2
  Top Layer w0.254: v1(42.54,72.8) 42.54,54.1 42.62,54.03 ; R5.1 19.92,75.94 20.95,74.9 36.09,74.9 38.2,72.8 v1(38.84,72.8)
  Bottom Layer w0.254: v1(38.84,72.8) v1(42.54,72.8)
SW4: length 45.4
  Top Layer w0.254: R7.1 26.31,76.54 27,75.84 37.19,75.84 38.81,74.22 v1(38.89,74.22) ; M1.37 42.62,51.71 43.92,53.01 43.92,59.28 43.28,59.92 v1(43.28,74.27)
  Bottom Layer w0.254: v1(43.28,74.27) 38.94,74.27 v1(38.89,74.22)
SW5: length 41.4
  Top Layer w0.254: R9.1 32.7,77.79 33.27,77.22 v1(37.95,77.22) ; v1(44.73,76.33) 44.73,71.27 46.46,69.55 46.46,52.78 M1.39
  Bottom Layer w0.254: v1(44.73,76.33) 43.81,77.24 37.95,77.24 v1(37.95,77.22)
SW6: length 26.8
  Top Layer w0.254: R11.1 39.06,80.38 39.06,75.51 40.08,74.5 40.08,54.03
SW7: length 31.2
  Top Layer w0.254: M1.35 41.5,52.91 41.5,74.3 45.48,78.28 R13.1
SW8: length 42.3
  Top Layer w0.254: v1(48.67,66.09) 51.88,69.3 R15.1
  Bottom Layer w0.254: v1(48.67,66.09) 37.79,66.09 36.35,64.64 36.35,52.83 M1.31
SW9: length 72
  Top Layer w0.254: M1.23 61.9,19 61.9,23.88 49.07,36.7 49.07,60.33 58.27,69.52 58.27,80.4
SW10: length 73.7
  Top Layer w0.254: R19.1 64.66,69.31 51.44,56.08 51.44,49.56 52.53,48.46 52.53,37.85 64.29,26.09 64.29,19.15 M1.25
SW11: length 31.8
  Top Layer w0.254: v1(58.22,59.79) 71.05,72.63 71.05,80.4
  Bottom Layer w0.254: 57.86,54.03 57.86,59.44 v1(58.22,59.79)
SW12: length 39.4
  Top Layer w0.254: R23.1 77.44,74.42 74.85,71.83 72.54,71.83 56.62,55.91 56.62,52.78 M1.47
SW13: length 37.8
  Top Layer w0.254: 60.4,54.03 60.4,56.67 74.42,70.69 77.39,70.69 83.84,77.13 R25.1
SW14: length 40.8
  Top Layer w0.254: R27.1 90.23,79.13 80.57,69.47 75.29,69.47 62.94,57.12 62.94,54.03
TOUCH3.3V: length 126.5
  Top Layer w0.254: 96.27,58.67 96.27,57 95.66,56.39 v1(86.49,56.39) ; 96.27,58.67 96.25,58.65 86.92,58.65 86.43,59.14 U2.3 ; 96.27,58.67 R31.2 ; v1(21.67,58.7) 21.66,58.71 R35.2
  Top Layer w0.508: R35.2 18.25,58.67 Q16.3
  Bottom Layer w0.254: v1(21.67,58.7) 21.67,48.72 27.89,42.49 83.77,42.49 86.49,45.21 v1(86.49,56.39)
TOUCH_OUT: length 94.5
  Top Layer w0.254: U2.2 87.43,61.11 88.11,60.43 v1(88.11,59.69) ; v1(41.4,27.79) 41.4,37.54 45.34,41.48 v1(48.29,41.48)
  Bottom Layer w0.254: v1(41.4,27.79) 41.4,19.28 M1.5 ; v1(48.29,41.48) 84.99,41.48 88.11,44.6 v1(88.11,59.69)
TOUCH_RX: length 55.4
  Top Layer w0.254: 65.48,54.03 65.48,56.29 68.83,59.64 80.19,59.64 84.43,63.88 U2.5 84.43,71.45 84.84,71.86 92.35,71.86 97.78,66.43 R31.1
TOUCH_TX: length 39.9
  Top Layer w0.254: M1.51 60.43,51.46 60.43,49.99 62.61,47.8 70.56,47.8 85.43,62.67 U2.4
USART1_RX: length 72.5
  Bottom Layer w0.254: 50.24,54.03 50.24,77.34 48.36,79.22 4.17,79.22 3.53,78.59 H1.2
USART1_TX: length 73.9
  Bottom Layer w0.254: M1.41 49,52.78 49,63.45 49.71,64.16 49.71,75.69 46.99,78.41 13.39,78.41 9.6,74.62 H1.1
USART3_RX: length 25.7
  Top Layer w0.254: M1.20 57.86,20.07 56.54,18.75 56.54,16.43 54.71,14.61 51.87,14.61 44.12,6.86 44.12,2.13
USART3_TX: length 22.7
  Top Layer w0.254: M1.19 57.86,15.72 55.22,13.08 51.49,13.08 46.66,8.25 46.66,2.13
USART6_RX: length 27.7
  Top Layer w0.254: 52.59,2.13 57.47,2.13 60.05,4.7 60.05,10.64 61.57,12.17 66.09,12.17 68.02,14.1 M1.27
USART6_TX: length 30.7
  Top Layer w0.254: M1.28 66.78,19.25 66.78,16.92 64.19,14.33 61.16,14.33 58.57,11.73 58.57,6.73 57.33,5.49 51.97,5.49 50.05,3.57 50.05,2.13
$1N5077: length 10.1
  Top Layer w0.381: BAT1.2 70.26,7.7 70.26,10.06 69.27,11.05 63.13,11.05
$1N5199: length 4.1
  Top Layer w0.381: U5.2 54.38,9.78 53.66,10.5 Y1.2
$1N5205: length 4
  Top Layer w0.381: U5.3 54.51,8.51 54,8 Y1.1
$1N8903: length 12.6
  Top Layer w0.381: SW1.4 SW1.3 20.27,1.76 arc(20.27,1.76) 20.27,1.76
$2N2294: length 10.5
  Top Layer w0.254: 6.65,84.99 D1.2 6.65,93.92 arc(6.73,94.12) 6.93,94.21 8.03,94.21 arc(8.04,94.22) CN1.2
$2N2302: length 3.6
  Top Layer w0.254: Q1.1 8.65,80.41 R1.2
$2N2313: length 10.5
  Top Layer w0.254: 13.04,84.99 D2.2 13.04,93.92 arc(13.12,94.12) 13.33,94.21 14.42,94.21 arc(14.44,94.22) CN2.2
$2N2321: length 3.6
  Top Layer w0.254: Q2.1 15.04,80.41 R3.2
$2N2332: length 10.5
  Top Layer w0.254: 19.43,84.99 D3.2 19.43,93.92 arc(19.52,94.12) 19.72,94.21 20.81,94.21 arc(20.83,94.22) CN3.2
$2N2340: length 3.6
  Top Layer w0.254: R5.2 21.43,80.41 Q3.1
$2N2351: length 10.5
  Top Layer w0.254: 25.82,84.99 D4.2 25.82,93.92 arc(25.91,94.12) 26.11,94.21 27.2,94.21 arc(27.22,94.22) CN4.2
$2N2359: length 3.6
  Top Layer w0.254: R7.2 27.82,80.41 Q4.1
$2N2370: length 10.5
  Top Layer w0.254: 32.22,84.99 32.22,93.92 arc(32.3,94.12) 32.5,94.21 33.59,94.21 arc(33.61,94.22) CN5.2
$2N2378: length 3.6
  Top Layer w0.254: Q5.1 34.21,80.41 R9.2
$2N2389: length 10.5
  Top Layer w0.254: 38.61,84.99 D6.2 38.61,93.92 arc(38.69,94.12) 38.89,94.21 39.99,94.21 arc(40,94.22) CN6.2
$2N2397: length 3.6
  Top Layer w0.254: R11.2 40.6,80.41 Q6.1
$2N2408: length 10.5
  Top Layer w0.254: 45,84.99 D7.2 45,93.92 arc(45.08,94.12) 45.29,94.21 46.38,94.21 arc(46.4,94.22) CN7.2
$2N2416: length 3.6
  Top Layer w0.254: Q7.1 47,80.41 R13.2
$2N2427: length 10.5
  Top Layer w0.254: 51.39,84.99 D8.2 51.39,93.92 arc(51.47,94.12) 51.68,94.21 52.77,94.21 arc(52.79,94.22) CN8.2
$2N2435: length 3.6
  Top Layer w0.254: R15.2 53.39,80.41 Q8.1
$2N2446: length 10.5
  Top Layer w0.254: 57.78,84.99 D9.2 57.78,93.92 arc(57.87,94.12) 58.07,94.21 59.16,94.21 arc(59.18,94.22) CN9.2
$2N2454: length 3.6
  Top Layer w0.254: R17.2 59.78,80.41 Q9.1
$2N2465: length 10.5
  Top Layer w0.254: 64.17,84.99 D10.2 64.17,93.92 arc(64.26,94.12) 64.46,94.21 65.55,94.21 arc(65.57,94.22) CN10.2
$2N2473: length 3.6
  Top Layer w0.254: Q10.1 66.17,80.41 R19.2
$2N2484: length 10.5
  Top Layer w0.254: 70.57,84.99 D11.2 70.57,93.92 arc(70.65,94.12) 70.85,94.21 71.95,94.21 arc(71.96,94.22) CN11.2
$2N2492: length 3.6
  Top Layer w0.254: R21.2 72.56,80.41 Q11.1
$2N2503: length 10.5
  Top Layer w0.254: 76.96,84.99 D12.2 76.96,93.92 arc(77.04,94.12) 77.25,94.21 78.34,94.21 arc(78.36,94.22) CN12.2
$2N2511: length 3.6
  Top Layer w0.254: Q12.1 78.96,80.41 R23.2
$2N2522: length 10.5
  Top Layer w0.254: 83.35,84.99 D13.2 83.35,93.92 arc(83.43,94.12) 83.64,94.21 84.73,94.21 arc(84.75,94.22) CN13.2
$2N2530: length 3.6
  Top Layer w0.254: Q13.1 85.35,80.41 R25.2
$2N2541: length 10.5
  Top Layer w0.254: 89.74,84.99 D14.2 89.74,93.92 arc(89.83,94.12) 90.03,94.21 91.12,94.21 arc(91.14,94.22) CN14.2
$2N2549: length 3.6
  Top Layer w0.254: R27.2 91.74,80.41 Q14.1
$2N2772: length 5.7
  Top Layer w0.381: Q15.2 93.28,19.69 arc(93.27,19.67) D15.1 93.25,16.17 arc(93.17,15.97) BUZZER1.1
$2N2814: length 2.6
  Top Layer w0.381: Q15.1 90.74,23.35 arc(90.71,23.36) R29.2
$4N1040: length 1.9
  Top Layer w0.508: 13.85,46.16 15.75,46.16 arc(15.75,46.16) 15.75,46.16
$4N2282: length 2.3
  Top Layer w0.508: LED1.2 5.68,61.62 arc(5.69,61.61) R34.1
$4N2367: length 3.8
  Top Layer w0.508: R35.1 18.29,61.95 arc(18.12,62.35) 17.73,62.51 16.55,62.51 arc(16.55,62.51) LED2.2
$4N3097: length 4.7
  Top Layer w0.305: U7.5 9.57,52.75 arc(9.47,52.52) 9.25,52.43 6.93,52.43 arc(6.68,52.53) 6.58,52.78 6.58,53.29 ; 6.58,53.29 arc(6.58,53.29) 6.58,53.3
$4N3104: length 1.7
  Top Layer w0.508: U7.4 10.52,55.24 arc(10.52,55.24) R37.2
$4N4057: length 9.1
  Top Layer w0.508: KEY1.2 14.28,20.13 DC1.1

## Copper pours and planes (outline as drawn; the poured copper is in the pictures)
GND on Top Layer: -0.61,101.55 100.36,101.55 100.36,-0.38 -0.61,-0.38
GND on Bottom Layer: -0.33,100.74 100.63,100.74 100.63,-1.19 -0.33,-1.19

Small or netless copper shapes (teardrops, artwork), in the pictures only: 391 on Top Layer, 117 on Bottom Layer

## Text on the board
Bottom Silkscreen Layer: PD3 | PG14 | PB8 | PA3 | PA7 | PA4 | PH3 | PC5 | PB1 | PB12 | PD4 | PD7 | PC1 | PH5 | PH4 | PA2 | PH2 | PC2 | PD11 | PB13
Top Silkscreen Layer: 指纹模块 | PC4 | PC3 | PD3 | PG14 | PB8 | PA3 | PA7 | PA4 | PH3 | PC5 | PB1 | PB12 | PB13 | PD11 | PH4 | PD4 | PH2 | PD7 | PH5 | PC2 | PA2 | PC1 | US1_RX | US1_TX | US7_TX | US7_RX | 3.3 | US4_RX | US4_TX | US3_RX | US3_TX | US6_TX | GND | 6_RX | 5V
